# Altium schematic sheet Alimentação.SchDoc: Alimentação
size A4; DrawnBy: João Bortolace; Revision: 1.0; SheetNumber: 3; SheetTotal: 6
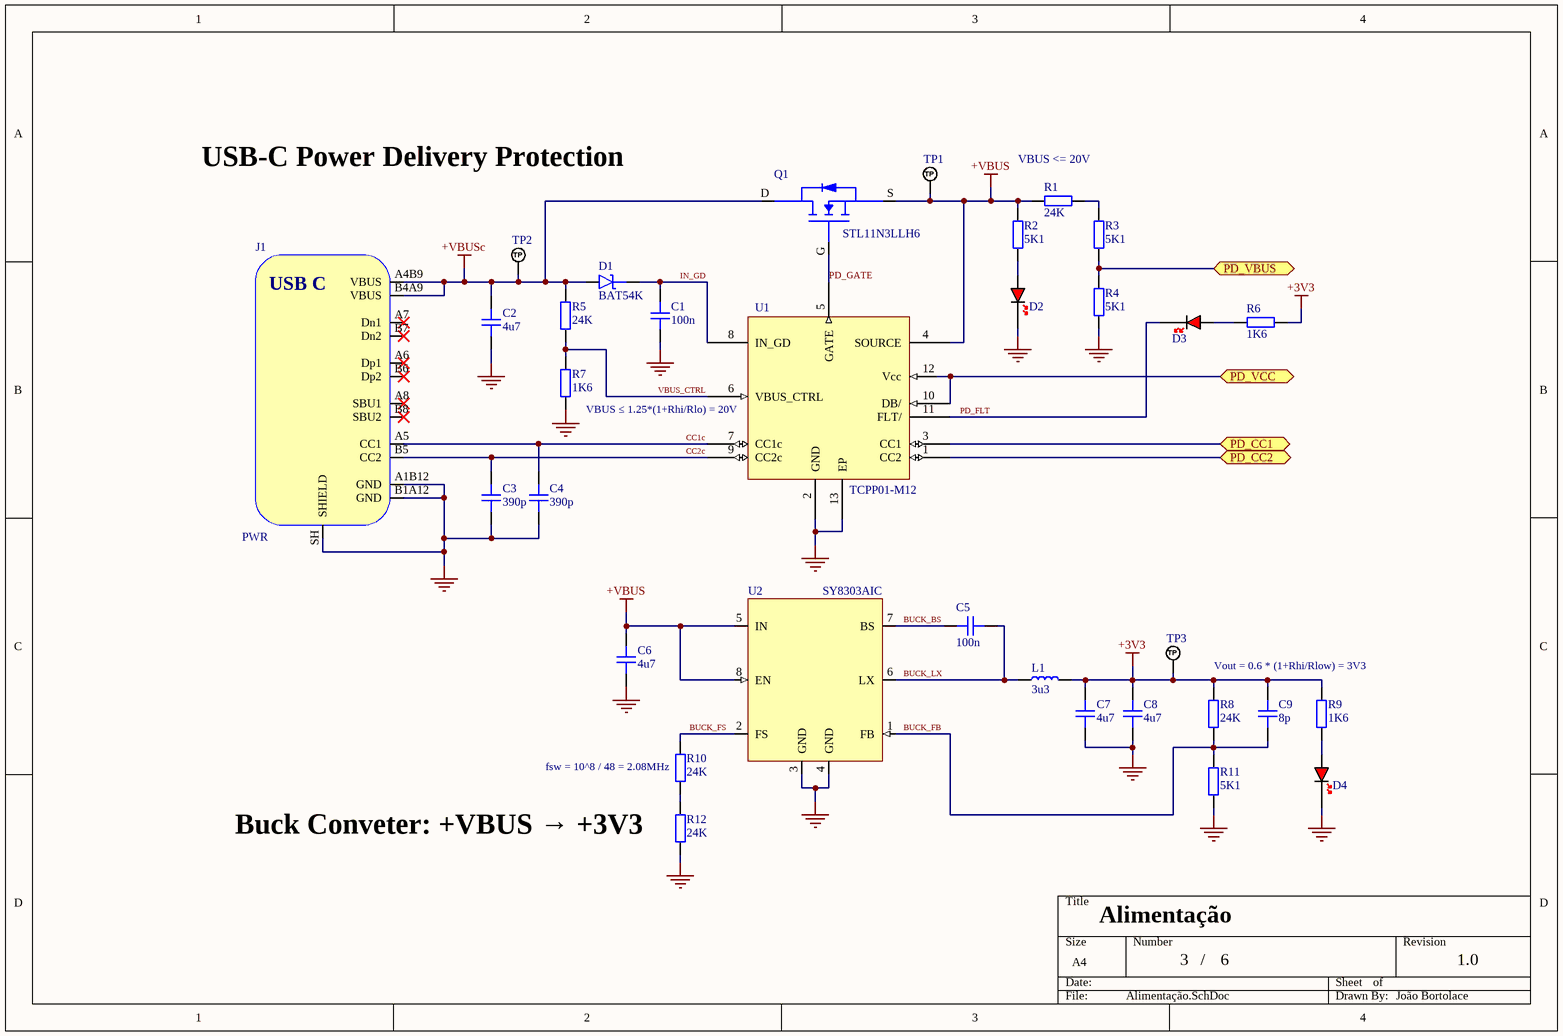
[diagram p0: Alimentação.SchDoc]

## Parts
C1  100n  [CAP_0402]
C2  4u7  [CAP_0805]
C3  390p  [CAP_0603]
C4  390p  [CAP_0603]
C5  100n  [CAP_0402]
C6  4u7  [CAP_0805]
C7  4u7  [CAP_0805]
C8  4u7  [CAP_0805]
C9  8p  [CAP_0402]
D1  BAT54K  [SOD-323]
D2  +VBUS  [LED_0402_RED]  (value not drawn)
D3  FLT  [LED_0402_RED]  (value not drawn)
D4  +3V3  [LED_0402_RED]  (value not drawn)
J1  PWR  [USB4105-GF-A-060]
L1  3u3  [SRP3212A]
Q1  STL11N3LLH6  [PowerFLAT 3.3x3.3]
R1  24K  [RES_0402]
R2  5K1  [RES_0402]
R3  5K1  [RES_0402]
R4  5K1  [RES_0402]
R5  24K  [RES_0402]
R6  1K6  [RES_0402]
R7  1K6  [RES_0402]
R8  24K  [RES_0402]
R9  1K6  [RES_0402]
R10  24K  [RES_0402]
R11  5K1  [RES_0402]
R12  24K  [RES_0402]
TP1  TP_NOBOM  [PAD_RND_1MM]  (value not drawn)  (no BOM)
TP2  TP_NOBOM  [PAD_RND_1MM]  (value not drawn)  (no BOM)
TP3  TP_NOBOM  [PAD_RND_1MM]  (value not drawn)  (no BOM)
U1  TCPP01-M12  [QFN-12L]
U2  SY8303AIC  [TSOT23-8]

## Ports
PD_CC1 (bidir, see Esquemático Principal[2B], Microcontrolador[1C]), PD_CC2 (bidir, see Esquemático Principal[2B], Microcontrolador[1B]), PD_VBUS (bidir, see Esquemático Principal[2B], Microcontrolador[3B]), PD_VCC (bidir, see Esquemático Principal[2B], Microcontrolador[1D])

## Nets
+3V3: C7.2 C8.2 C9.2 L1.2 R6.1 R8.2 R9.2 TP3.1(TP)
+VBUS: C6.2 Q1.S R1.2 R2.2 TP1.1(TP) U1.4(SOURCE) U2.5(IN) U2.8(EN)
+VBUSc: C2.2 D1.A J1.A4B9(VBUS) J1.B4A9(VBUS) Q1.D R5.2 TP2.1(TP)
GND: C1.1 C2.1 C3.1 C4.1 C6.1 C7.1 C8.1 D2.K D4.K J1.A1B12(GND) J1.B1A12(GND) J1.SH(SHIELD) R4.1 R7.1 R11.1 R12.1 U1.2(GND) U1.13(EP) U2.3(GND) U2.4(GND)
BUCK_BS: C5.1 U2.7(BS)
BUCK_FB: C9.1 R8.1 R11.2 U2.1(FB)
BUCK_FS: R10.2 U2.2(FS)
BUCK_LX: C5.2 L1.1 U2.6(LX)
CC1c: C4.2 J1.A5(CC1) U1.7(CC1c)
CC2c: C3.2 J1.B5(CC2) U1.9(CC2c)
IN_GD: C1.2 D1.K U1.8(IN_GD)
PD_CC1: U1.3(CC1) ; port PD_CC1
PD_CC2: U1.1(CC2) ; port PD_CC2
PD_FLT: D3.K U1.11(FLT/)
PD_GATE: Q1.G U1.5(GATE)
PD_VBUS: R3.2 R4.2 ; port PD_VBUS
PD_VCC: U1.10(DB/) U1.12(Vcc) ; port PD_VCC
VBUS_CTRL: R5.1 R7.2 U1.6(VBUS_CTRL)
NetD2_A: D2.A R2.1
NetD3_A: D3.A R6.2
NetD4_A: D4.A R9.1
NetR1_1: R1.1 R3.1
NetR10_1: R10.1 R12.2

Not connected (* = marked no-connect by the designer): J1 A6(Dp1)* A7(Dn1)* A8(SBU1)* B6(Dp2)* B7(Dn2)* B8(SBU2)*

## Notes on the sheet
- USB-C Power Delivery Protection
- VBUS <= 20V
- (near U1) VBUS ≤ 1.25*(1+Rhi/Rlo) = 20V
- Vout = 0.6 * (1+Rhi/Rlow) = 3V3
- (near R10) fsw = 10^8 / 48 = 2.08MHz
- Buck Conveter: +VBUS → +3V3
- /
- (in symbol USB4105-GF-A-060) USB C

## Library data of the parts
C1 C5 = CAP_0402: 100nF ±10% 50V Ceramic Capacitor X7R 0402D 0402; Manufacturer: muRata; Manufacturer Part Number: GRM155R71H104KE14D; Distributor Link: https://www.lcsc.com/product-detail/C77020.html; LCSC: C77020; Rating: *; Dielectric: *
C2 C6-C8 = CAP_0805: 4.7uF ±10% 50V Ceramic Capacitor X5R 0805; Manufacturer: Samsung Electro-Mechanics; Manufacturer Part Number: CL21A475KBQNNNE; Distributor Link: https://www.lcsc.com/product-detail/C98192.html?s_z=n_capacitor%25204.7u; LCSC: C98192; Rating: *; Dielectric: *
C3 C4 = CAP_0603: 390pF ±5% 50V Ceramic Capacitor C0G 0603; Manufacturer: muRata; Manufacturer Part Number: GRM1885C1H391JA01D; Distributor Link: https://www.lcsc.com/product-detail/C701309.html?s_z=n_C701309; LCSC: C701309; Rating: 50V; Dielectric: C0G
C9 = CAP_0402: 8pF ±1% 50V Ceramic Capacitor C0G 0402; Manufacturer: muRata; Manufacturer Part Number: GCM1555C1H8R0FA16D; Distributor Link: https://www.lcsc.com/product-detail/C1864375.html?utm_source=octopart&utm_medium=cpc&utm_campaign=GCM1555C1H8R0FA16D; LCSC: C1864375; Rating: 50V; Dielectric: C0G
D1 = D_SCHOTTKY_SOD_323: Diode Schottky SMD SOD-323; Manufacturer: STMicroelectronics; Manufacturer Part Number: BAT54KFILM; Part Link: https://www.lcsc.com/product-detail/C283259.html?s_z=n_BAT54K; LCSC: C283259
D2-D4 = LED_0402_RED: LED 0402 RED SMD
J1 = USB4105-GF-A-060: USB-C (USB TYPE-C) Receptacle Connector 16 Position Surface Mount, Right Angle; Manufacturer: DEALON; Manufacturer Part Number: USB-TYPE-C-018; Part Link: https://www.lcsc.com/product-detail/C2927038.html?s_z=n_usb%2520type%2520c; LCSC: C2927038
L1 = SRP3212A-*: Inductor 3u3 3.4A  87mΩ 1210 Fixed Inductors RoHS; Manufacturer: Bourns; Manufacturer Part Number: SRP3212A-3R3M; Distributor Link: https://www.lcsc.com/product-detail/C19779117.html?s_z=n_SRP3212A-%2a; LCSC: C19779117
Q1 = STL11N3LLH6: Mosfet N-channel 30 V, 6 mΩ typ., 11 A; Manufacturer: STMicroelectronics; Manufacturer Part Number: STL11N3LLH6; Part Link: https://www.mouser.com/ProductDetail/STMicroelectronics/STL11N3LLH6?qs=CBOTe0%252BbgkbnVaR%2FX25%2FKw%3D%3D; LCSC: C2965326
R1-R12 = RES_0402: Resistor SMD 0402; Manufacturer: *; Manufacturer Part Number: *; Distributor Link: *; LCSC: *
TP1-TP3 = TEST_POINT_RND_1MM: Test Point Round 1mm (NO BOM)
U1 = TCPP01-M12: USB Type-C™ and power delivery protection for sink application; Manufacturer: STMicroelectronics; Manufacturer Part Number: TCPP01-M12; ComponentLink1Description: Datasheet; ComponentLink1URL: *; Part Link: https://www.mouser.com/ProductDetail/STMicroelectronics/TCPP01-M12?qs=%252B6g0mu59x7KCafIwapwG2A%3D%3D; LCSC: C1121848; Mouser: 511-TCPP01-M12
U2 = SY8303AIC: High Efficiency Fast Response, 3A, 40V Input Synchronous Step Down Regulator; Manufacturer: Silergy; Manufacturer Part Number: SY8303AIC; Distributor Link: https://www.lcsc.com/product-detail/DC-DC-Converters_Silergy-Corp-SY8303AIC_C97054.html; LCSC: C97054